# Altium project Thermistor_Expansion_PCB_GND.PrjPcb
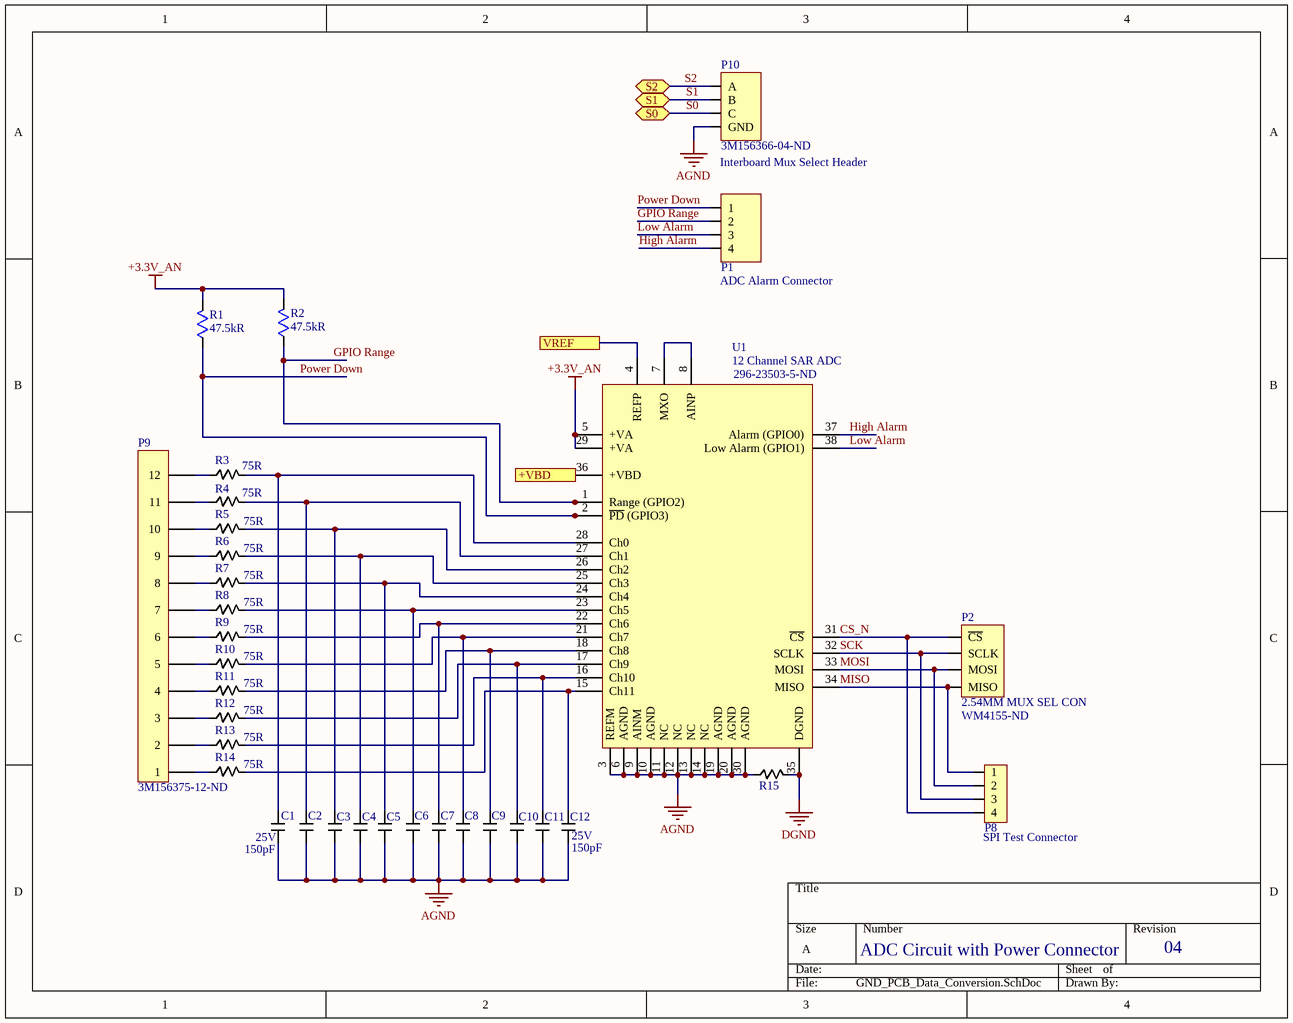
[diagram p0: GND_PCB_Data_Conversion.SchDoc]
3 sheets, 54 parts. Net scope: flat (ports and power ports of the same name join across sheets).
Board file: Middle_Stack_PCB.PcbDoc
Sheets:
  GND_PCB_Data_Conversion.SchDoc
  4X_22_GND_Pin_Connector.SchDoc
  ADC_PowerSupply.SchDoc

## Sheet GND_PCB_Data_Conversion.SchDoc
size A

### Parts
C1  Capacitance: 150pF  Voltage Rating: 25V  [150PF Cap Charge Resevoir]  (hidden comment: 150PF Charge Res Caps)
C2  150PF Charge Res Caps  [150PF Cap Charge Resevoir]  (value not drawn)
C3  150PF Charge Res Caps  [150PF Cap Charge Resevoir]  (value not drawn)
C4  150PF Charge Res Caps  [150PF Cap Charge Resevoir]  (value not drawn)
C5  150PF Charge Res Caps  [150PF Cap Charge Resevoir]  (value not drawn)
C6  150PF Charge Res Caps  [150PF Cap Charge Resevoir]  (value not drawn)
C7  150PF Charge Res Caps  [150PF Cap Charge Resevoir]  (value not drawn)
C8  150PF Charge Res Caps  [150PF Cap Charge Resevoir]  (value not drawn)
C9  150PF Charge Res Caps  [150PF Cap Charge Resevoir]  (value not drawn)
C10  150PF Charge Res Caps  [150PF Cap Charge Resevoir]  (value not drawn)
C11  150PF Charge Res Caps  [150PF Cap Charge Resevoir]  (value not drawn)
C12  Capacitance: 150pF  Voltage Rating: 25V  [150PF Cap Charge Resevoir]  (hidden comment: 150PF Charge Res Caps)
P1  4 pos ADC Alarm Header  [4POS 2.54MM HEADER MUX SEL]  (value not drawn)
P2  2.54MM MUX SEL CON  Supplier Part Number 1: WM4155-ND  [4POS 2.54MM HEADER MUX SEL]
P8  4POS SPI Test Connector Header Pin  [4POS SPI Test Connector]  (value not drawn)
P9  Supplier Part Number 1: 3M156375-12-ND  [12POS Dual Header W/0 3D Body]  (hidden comment: 12POS Dual Header W/O 3D Body)
P10  Supplier Part Number 1: 3M156366-04-ND  [Mux Select Interboard Connector]  (hidden comment: Mux Select Interboard Header)
R1  Resistance: 47.5kR  [Green_LED_Resistor_90.9]  (hidden comment: Green)
R2  Resistance: 47.5kR  [0603_MD_RES]  (hidden comment: 47.5k PullUp RES ADC)
R3  Resistance: 75R  [Chip2PinSM127P600-8N]  (hidden comment: 75 Ohm Charge Resevoir Resistor)
R4  Resistance: 75R  [Chip2PinSM127P600-8N]  (hidden comment: 75 Ohm Charge Resevoir Resistor)
R5  Resistance: 75R  [Chip2PinSM127P600-8N]  (hidden comment: 75 Ohm Charge Resevoir Resistor)
R6  Resistance: 75R  [Chip2PinSM127P600-8N]  (hidden comment: 75 Ohm Charge Resevoir Resistor)
R7  Resistance: 75R  [Chip2PinSM127P600-8N]  (hidden comment: 75 Ohm Charge Resevoir Resistor)
R8  Resistance: 75R  [Chip2PinSM127P600-8N]  (hidden comment: 75 Ohm Charge Resevoir Resistor)
R9  Resistance: 75R  [Chip2PinSM127P600-8N]  (hidden comment: 75 Ohm Charge Resevoir Resistor)
R10  Resistance: 75R  [Chip2PinSM127P600-8N]  (hidden comment: 75 Ohm Charge Resevoir Resistor)
R11  Resistance: 75R  [Chip2PinSM127P600-8N]  (hidden comment: 75 Ohm Charge Resevoir Resistor)
R12  Resistance: 75R  [Chip2PinSM127P600-8N]  (hidden comment: 75 Ohm Charge Resevoir Resistor)
R13  Resistance: 75R  [Chip2PinSM127P600-8N]  (hidden comment: 75 Ohm Charge Resevoir Resistor)
R14  Resistance: 75R  [Chip2PinSM127P600-8N]  (hidden comment: 75 Ohm Charge Resevoir Resistor)
R15  0 Ohm Resistor  [0 Ohm Resistor]  (value not drawn)
U1  12 Channel SAR ADC  Supplier Part Number 1: 296-23503-5-ND  [12 Channel SAR ADC]

### Ports
+VBD, S0 (bidir), S1 (bidir), S2 (bidir), VREF

### Nets
+3.3V_AN: R1.2 R2.2 U1.5(+VA) U1.29(+VA)
AGND: C1.1 C2.1 C3.1 C4.1 C5.1 C6.1 C7.1 C8.1 C9.1 C10.1 C11.1 C12.1 P10.4(GND) R15.1 U1.3(REFM) U1.6(AGND) U1.9(AINM) U1.10(AGND) U1.11(NC) U1.12(NC) U1.13(NC) U1.14(NC) U1.19(AGND) U1.20(AGND) U1.30(AGND)
DGND: R15.2 U1.35(DGND)
+VBD: U1.36(+VBD) ; port +VBD
CS_N: P2.4(~{CS}) P8.4 U1.31(~{CS})
GPIO Range: P1.2 R2.1 U1.1(Range_(GPIO2))
High Alarm: P1.4 U1.37(Alarm_(GPIO0))
Low Alarm: P1.3 U1.38(Low_Alarm_(GPIO1))
MISO: P2.1(MISO) P8.1 U1.34(MISO)
MOSI: P2.2(MOSI) P8.2 U1.33(MOSI)
Power Down: P1.1 R1.1 U1.2(~{PD}_(GPIO3))
S0: P10.3(C) ; port S0
S1: P10.2(B) ; port S1
S2: P10.1(A) ; port S2
SCK: P2.3(SCLK) P8.3 U1.32(SCLK)
VREF: U1.4(REFP) ; port VREF
NetC1_2: C1.2 R3.2 U1.28(Ch0)
NetC2_2: C2.2 R4.2 U1.27(Ch1)
NetC3_2: C3.2 R5.2 U1.26(Ch2)
NetC4_2: C4.2 R6.2 U1.25(Ch3)
NetC5_2: C5.2 R7.2 U1.24(Ch4)
NetC6_2: C6.2 R8.2 U1.23(Ch5)
NetC7_2: C7.2 R9.2 U1.22(Ch6)
NetC8_2: C8.2 R10.2 U1.21(Ch7)
NetC9_2: C9.2 R11.2 U1.18(Ch8)
NetC10_2: C10.2 R12.2 U1.17(Ch9)
NetC11_2: C11.2 R13.2 U1.16(Ch10)
NetC12_2: C12.2 R14.2 U1.15(Ch11)
NetP9_1: P9.1 R14.1
NetP9_2: P9.2 R13.1
NetP9_3: P9.3 R12.1
NetP9_4: P9.4 R11.1
NetP9_5: P9.5 R10.1
NetP9_6: P9.6 R9.1
NetP9_7: P9.7 R8.1
NetP9_8: P9.8 R7.1
NetP9_9: P9.9 R6.1
NetP9_10: P9.10 R5.1
NetP9_11: P9.11 R4.1
NetP9_12: P9.12 R3.1
NetU1_7: U1.7(MXO) U1.8(AINP)

### Notes on the sheet
- Interboard Mux Select Header
- (near P1) ADC Alarm Connector
- (near P8) SPI Test Connector
- ADC Circuit with Power Connector
- 04

### Library data of the parts
C1-C12 = 150PF Charge Res Caps: Charge Res Caps for ADC input channels; Manufacturer: KEMET; Manufacturer Part Number: C0402C151J3GAC7867; Tolerance: 5%; Supplier 1: Digi-Key; Stock 1: 18237; Pricing 1: 1=0.10000, 10=0.04300, 100=0.01920, 500=0.01374, 1000=0.01080, 2500=0.00982, 5000=0.00903 (USD); Mount: Surface Mount; Case/Package: 0402; Min Operating Temperature: -55°C; Max Operating Temperature: 125°C; Packaging: Cut Tape; ComponentLink1URL: http://components.arrow.com/part/dataview/46126249S9911696N7429?src-supplier=Arrow; ComponentLink1Description: http://components.arrow.com/part/dataview/46126249S9911696N7429?src-supplier=Arrow; ComponentLink2URL: http://www.kemet.com/docfinder?Partnumber=C0402C151J3GACTU&src-supplier=Digi-Key; ComponentLink2Description: http://www.kemet.com/docfinder?Partnumber=C0402C151J3GACTU&src-supplier=Digi-Key; Supplier Part Number 1: 399-14422-1-ND; Case Code (Imperial): 0402; Case Code (Metric): 1005; ComponentLink3URL: https://api.kemet.com/component-edge/download/datasheet/C0402C151J3GACTU.pdf?src-supplier=Digi-Key; ComponentLink3Description: https://api.kemet.com/component-edge/download/datasheet/C0402C151J3GACTU.pdf?src-supplier=Digi-Key; ComponentLink4URL: http://datasheet.octopart.com/C0402C151J3GAC7867-KEMET-datasheet-84169754.pdf; ComponentLink4Description: http://datasheet.octopart.com/C0402C151J3GAC7867-KEMET-datasheet-84169754.pdf
P1 = 4 pos ADC Alarm Header: Connector Header Through Hole, Right Angle 4 position 0.100" (2.54mm); Manufacturer: Molex; Manufacturer Part Number: 0705530108; Contact Resistance: 30mR; Number of Positions: 4; Connector Type: Male Pin; Pitch: 0.1inch; Supplier 1: Digi-Key; Stock 1: 858; Pricing 1: 1=2.03000, 10=1.83800, 100=1.57500, 500=1.31250, 1000=1.12500, 5000=0.99750, 10000=0.97500 (USD); RoHS: Yes; Mount: Through Hole; Contact Plating: Gold; Contact Material: Bronze; Housing Material: Polyester; Color: Black; Housing Color: Black; Min Operating Temperature: -40°C; Max Operating Temperature: 105°C; Number of Rows: 1; Packaging: Rail/Tube; Termination: Solder; Orientation: Right Angle; Fastening Type: Latch; Length: 12.71mm; Contact Mating Length: 0.24inch; Depth: 13.59mm; Radiation Hardening: No; ComponentLink1URL: https://datasheet.ciiva.com/6829/705530106-sd-6829901.pdf?src-supplier=Digi-Key; ComponentLink1Description: https://datasheet.ciiva.com/6829/705530106-sd-6829901.pdf?src-supplier=Digi-Key; ComponentLink2URL: https://datasheet.ciiva.com/16498/0705530108-pcb-headers-16498173.pdf?src-supplier=Avnet+Asia; ComponentLink2Description: https://datasheet.ciiva.com/16498/0705530108-pcb-headers-16498173.pdf?src-supplier=Avnet+Asia; Supplier Part Number 1: WM4155-ND
P2 = 2.54MM MUX SEL CON: SPI Connector; Manufacturer: Molex; Manufacturer Part Number: 0705530108; Contact Resistance: 30mR; Number of Positions: 4; Connector Type: Male Pin; Pitch: 0.1inch; Voltage Rating: 250V; Current Rating: 3A; Gender: Male; Insulation Resistance: 1GR; Glow Wire Compliant: Non-compliant; Supplier 1: Digi-Key; Stock 1: 1281; Mount: Through Hole; Contact Plating: Gold; Contact Material: Bronze; Housing Material: Polyester; Color: Black; Housing Color: Black; Min Operating Temperature: -40°C; Max Operating Temperature: 105°C; Number of Rows: 1; Packaging: Rail/Tube; Termination: Solder; Orientation: Right Angle; Fastening Type: Latch; Length: 12.71mm; Contact Mating Length: 0.24inch; Depth: 13.59mm; Radiation Hardening: No; ComponentLink1URL: https://www.molex.com/pdm_docs/ps/PS-70400.pdf?src-supplier=Digi-Key; ComponentLink1Description: https://www.molex.com/pdm_docs/ps/PS-70400.pdf?src-supplier=Digi-Key; ComponentLink2URL: http://www.molex.com/webdocs/datasheets/pdf/en-us/0705530108_PCB_HEADERS.pdf?src-supplier=Avnet+Asia; ComponentLink2Description: http://www.molex.com/webdocs/datasheets/pdf/en-us/0705530108_PCB_HEADERS.pdf?src-supplier=Avnet+Asia; Pricing 1: 1=2.03, 10=1.838, 100=1.575, 500=1.3125, 1680=1.0875, 5040=0.9975, 10080=0.975 (USD); Material: Brass; Package Quantity: 1680; Number of Contacts: 4; Voltage Rating (DC): 250V; Number of Circuits: 4; REACH SVHC: Unknown; ELV: Compliant; Flammability Rating: UL94 V-0; ComponentLink3URL: http://www.farnell.com/datasheets/2027073.pdf?src-supplier=Element14; ComponentLink3Description: http://www.farnell.com/datasheets/2027073.pdf?src-supplier=Element14; ComponentLink4URL: http://www.molex.com/webdocs/datasheets/pdf/en-us/0705530108_PCB_HEADERS.pdf?src-supplier=Avnet; ComponentLink4Description: http://www.molex.com/webdocs/datasheets/pdf/en-us/0705530108_PCB_HEADERS.pdf?src-supplier=Avnet; ComponentLink5URL: http://www.mouser.com/ds/2/276/0705530108_PCB_HEADERS-172949.pdf?src-supplier=Mouser; ComponentLink5Description: http://www.mouser.com/ds/2/276/0705530108_PCB_HEADERS-172949.pdf?src-supplier=Mouser
P8 = 4POS SPI Test Connector Header Pin: Connector Header Through Hole, Right Angle 4 position 0.100" (2.54mm); Manufacturer: TE Connectivity; Manufacturer Part Number: 640455-4; Underplate Material: Nickel; Contact Resistance: 6mR; Current Rating: 5A; Voltage Rating: 250V; Number of Positions: 4; Connector Type: Plug,Header,Pin; Backwall/Post Interruptions: No (Without); Connector System: Wire-to-Board; Plating Thickness: 3.81um; PCB Mount Retention: Without; Contact Post Length: 3.56mm; PCB Thickness: 0.063inch; Approvals: CSA; Supplier 1: Digi-Key; Stock 1: 4333; Pricing 1: 1=0.14000, 10=0.12700, 100=0.08780, 500=0.07430, 1000=0.06080, 5000=0.05404, 10000=0.05066 (USD); RoHS: Yes; Mount: Through Hole; Contact Material: Copper Alloy; Contact Plating: Tin; Color: Natural,Beige; Housing Color: Natural; Housing Material: Polyester; Contact Shape: Square; Min Operating Temperature: -67°C; Max Operating Temperature: 221°C; Number of Rows: 1; Packaging: Bulk; Package Quantity: 1; Contact Gender: Male; Max Voltage Rating (AC): 250V; Termination: Solder; Number of Contacts: 4; Orientation: Right Angle; Voltage Rating (AC): 250V; Contact Retention: No (Without); Mating Alignment: No (Without); Mating Retention: No (Without); PCB Mount Alignment: No (Without); PCB Mounting Orientation: Right Angle; Sealable: No (Without); Strain Relief: No (Without); Shrouded: No (Without); Contact Current Rating: 5A; Length: 0.4inch; Height: 7.75mm; Pitch: 2.54mm; Contact Mating Length: 0.295inch; Depth: 11.05mm; Tail Length: 3.56mm; Radiation Hardening: No; REACH SVHC: Unknown; Flammability Rating: UL94 V-0; ELV: Compliant; Lead Free: Lead Free; ComponentLink1URL: https://datasheet.ciiva.com/16499/eng-ds-82056-mta-0608-16499288.pdf?src-supplier=Future+Electronics; ComponentLink1Description: https://datasheet.ciiva.com/16499/eng-ds-82056-mta-0608-16499288.pdf?src-supplier=Future+Electronics; ComponentLink2URL: https://datasheet.ciiva.com/11752/0900766b81020fb4-11752965.pdf?src-supplier=RSComponents; ComponentLink2Description: https://datasheet.ciiva.com/11752/0900766b81020fb4-11752965.pdf?src-supplier=RSComponents; ComponentLink3URL: https://datasheet.ciiva.com/30226/8852eng-ds-82056-mta-0608-30226713.pdf?src-supplier=Onlinecomponents.com; ComponentLink3Description: https://datasheet.ciiva.com/30226/8852eng-ds-82056-mta-0608-30226713.pdf?src-supplier=Onlinecomponents.com; ComponentLink4URL: https://datasheet.ciiva.com/709/eng-cd-640455-y2-709686.pdf?src-supplier=Digi-Key; ComponentLink4Description: https://datasheet.ciiva.com/709/eng-cd-640455-y2-709686.pdf?src-supplier=Digi-Key; Supplier Part Number 1: A19452-ND
P9 = 12POS Dual Header W/O 3D Body: Connector Header Through Hole 12 position 0.100" (2.54mm); Manufacturer: 3M; Manufacturer Part Number: 929715-06-06-EU; Number of Positions: 12; Gender: Male; Connector Type: Male Pin; Pitch: 0.1inch; Supplier 1: Digi-Key; Stock 1: 0; Pricing 1: 1=1.86000, 10=1.69000, 25=1.58600, 50=1.51720, 100=1.44820, 250=1.31024, 500=1.20680 (USD); RoHS: Yes; Mount: Through Hole; Color: Black; Contact Plating: Gold; Package Quantity: 500; Number of Rows: 2; Packaging: Bulk; Termination: Solder; Row Spacing: 0.1inch; Contact Mating Length: 0.318inch; ComponentLink1URL: http://components.arrow.com/part/dataview/42715320S8912076N3321?src-supplier=Arrow; ComponentLink1Description: http://components.arrow.com/part/dataview/42715320S8912076N3321?src-supplier=Arrow; ComponentLink2URL: http://www.mouser.com/ds/2/1/ts0769-35914.pdf?src-supplier=Mouser; ComponentLink2Description: http://www.mouser.com/ds/2/1/ts0769-35914.pdf?src-supplier=Mouser; ComponentLink3URL: http://multimedia.3m.com/mws/mediawebserver?66666UuZjcFSLXTtmXME5x46EVuQEcuZgVs6EVs6E666666--?src-supplier=Digi-Key; ComponentLink3Description: http://multimedia.3m.com/mws/mediawebserver?66666UuZjcFSLXTtmXME5x46EVuQEcuZgVs6EVs6E666666--?src-supplier=Digi-Key
P10 = Mux Select Interboard Header: Connector Header Through Hole 4 position 0.100" (2.54mm); Manufacturer: 3M; Manufacturer Part Number: 929710-06-02-RK; Number of Positions: 4; Gender: Male; Connector Type: Male Pin; Pitch: 0.1inch; Supplier 1: Digi-Key; Stock 1: 0; Pricing 1: 1=0.55000, 10=0.52000, 25=0.46800, 50=0.41600, 100=0.39870, 250=0.36400, 500=0.34666 (USD); Mount: Through Hole; Color: Black; Contact Plating: Tin; Package Quantity: 1000; Number of Rows: 2; Packaging: Bulk; Termination: Solder; Row Spacing: 0.1inch; Contact Mating Length: 0.318inch; ComponentLink1URL: https://datasheet.ciiva.com/6818/ts0769-6818121.pdf?src-supplier=Digi-Key; ComponentLink1Description: https://datasheet.ciiva.com/6818/ts0769-6818121.pdf?src-supplier=Digi-Key; ComponentLink2URL: https://datasheet.ciiva.com/15402/ts0769-15402221.pdf?src-supplier=Mouser; ComponentLink2Description: https://datasheet.ciiva.com/15402/ts0769-15402221.pdf?src-supplier=Mouser
R1 R2 = 47.5k PullUp RES ADC: RES 47.5K OHM 0.5% 1/10W 0603; Manufacturer: Stackpole Electronics; Manufacturer Part Number: RNCF0603DTE47K5; Power Rating: 63mW; Mount: Surface Mount; Case/Package: 0603; Min Operating Temperature: -55°C; Max Operating Temperature: 155°C; Tolerance: 0.5%; Packaging: Tape and Reel; ComponentLink1URL: http://datasheet.octopart.com/RNCF0603DTE47K5-Stackpole-Electronics-datasheet-10788241.pdf?src-supplier=Stackpole+Electronics; ComponentLink1Description: http://datasheet.octopart.com/RNCF0603DTE47K5-Stackpole-Electronics-datasheet-10788241.pdf?src-supplier=Stackpole+Electronics; ComponentLink2URL: http://datasheet.octopart.com/RNCF0603DTE47K5-Stackpole-Electronics-datasheet-12511394.pdf?src-supplier=Stackpole+Electronics; ComponentLink2Description: http://datasheet.octopart.com/RNCF0603DTE47K5-Stackpole-Electronics-datasheet-12511394.pdf?src-supplier=Stackpole+Electronics; ComponentLink3URL: http://datasheet.octopart.com/RNCF0603DTE47K5-Stackpole-Electronics-datasheet-11755897.pdf; ComponentLink3Description: http://datasheet.octopart.com/RNCF0603DTE47K5-Stackpole-Electronics-datasheet-11755897.pdf; Supplier 1: Digi-Key; Stock 1: 5000; Pricing 1: 1=0.15000, 10=0.12700, 100=0.04970, 1000=0.02079, 2500=0.01906 (USD); Supplier Part Number 1: RNCF0603DTE47K5CT-ND
R3-R14 = 75 Ohm Charge Resevoir Resistor: Manufacturer: Rohm; Manufacturer Part Number: KTR03EZPF75R0; Tolerance: 1%; Max Power Dissipation: 100mW; Temperature Coefficient: 100ppm/°C; Supplier 1: Digi-Key; Stock 1: 9052; Pricing 1: 1=0.15000, 10=0.13500, 100=0.05200, 1000=0.02287, 2500=0.01975 (USD); RoHS: Yes; Case/Package: 0603; Case Code (Metric): 1608; Case Code (Imperial): 0603; Min Operating Temperature: -55°C; Max Operating Temperature: 155°C; Package Quantity: 1; Packaging: Cut Tape; Composition: Thick Film; Number of Terminations: 2; Features: Automotive AEC-Q200; Length: 0.063inch; Height: 0.022inch; Width: 0.031inch; ComponentLink1URL: https://datasheet.ciiva.com/14930/ktr-14930245.pdf?src-supplier=Digi-Key; ComponentLink1Description: https://datasheet.ciiva.com/14930/ktr-14930245.pdf?src-supplier=Digi-Key; ComponentLink2URL: https://datasheet.ciiva.com/14924/ktr-14924923.pdf?src-supplier=Digi-Key; ComponentLink2Description: https://datasheet.ciiva.com/14924/ktr-14924923.pdf?src-supplier=Digi-Key; ComponentLink3URL: https://datasheet.ciiva.com/14928/ktr-14928475.pdf?src-supplier=Digi-Key; ComponentLink3Description: https://datasheet.ciiva.com/14928/ktr-14928475.pdf?src-supplier=Digi-Key; Supplier Part Number 1: RHM75AYCT-ND
R15 = 0 Ohm Resistor: 0 Ohm Resistor for connecting polygon pours
U1 = 12 Channel SAR ADC: 12 Bit SAR ADC; Manufacturer: Texas Instruments; Manufacturer Part Number: ADS7952SDBT; Min Supply Voltage: 2.7V; Max Supply Voltage: 5.25V; Interface: SPI; Number of Channels: 12; Sampling Rate: 1MS/s; Number of Converters: 1; Resolution: 12b; Polarity: Unipolar; Supply Type: Analog; Integral Nonlinearity (INL): 1.5LSB; Signal to Noise Ratio (SNR): 71.7dB; Power Consumption: 11.5mW; Operating Supply Voltage: 3.3V; Full Scale Error: 2LSB; Power Dissipation: 14.5mW; Nominal Supply Current: 2.3mA; Supplier 1: Digi-Key; Stock 1: 1697; Pricing 1: 1=9.30000, 10=8.40000, 50=8.00940, 100=6.95450, 500=6.05586, 1000=5.27445 (USD); RoHS: Yes; Mount: Surface Mount; Case/Package: TSSOP; Number of Pins: 38; Contact Plating: Gold; Min Operating Temperature: -40°C; Max Operating Temperature: 125°C; Packaging: Rail/Tube; Package Quantity: 50; Number of Bits: 12; Number of Elements: 1; Number of A/D Converters: 1; Number of Analog Inputs: 12; Conversion Rate: 1MS/s; Number of Inputs: 12; Radiation Hardening: No; Lead Free: Lead Free; REACH SVHC: No SVHC; ComponentLink1URL: https://datasheet.ciiva.com/41460/001186285-da-01-en-ic-adc-12bit-1m-ads7952sdbt-tssop-38-tid-41460243.pdf?src-supplier=Conrad; ComponentLink1Description: https://datasheet.ciiva.com/41460/001186285-da-01-en-ic-adc-12bit-1m-ads7952sdbt-tssop-38-tid-41460243.pdf?src-supplier=Conrad; ComponentLink2URL: https://datasheet.ciiva.com/14258/ads7961-14258981.pdf?src-supplier=Avnet; ComponentLink2Description: https://datasheet.ciiva.com/14258/ads7961-14258981.pdf?src-supplier=Avnet; ComponentLink3URL: https://datasheet.ciiva.com/1263/ads7950-1263926.pdf?src-supplier=Digi-Key; ComponentLink3Description: https://datasheet.ciiva.com/1263/ads7950-1263926.pdf?src-supplier=Digi-Key

## Sheet 4X_22_GND_Pin_Connector.SchDoc
size A
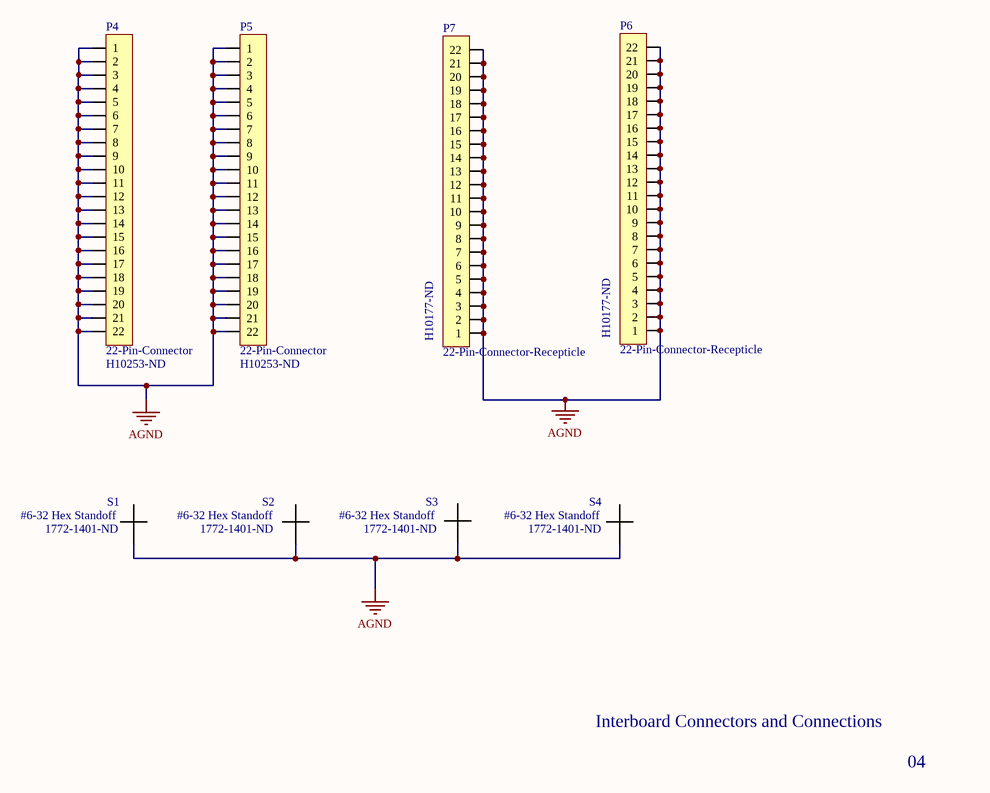
[diagram p1: 4X_22_GND_Pin_Connector.SchDoc]

### Parts
P4  22-Pin-Connector  Supplier Part Number 1: H10253-ND  [22-Pin Conenctor]
P5  22-Pin-Connector  Supplier Part Number 1: H10253-ND  [22-Pin Conenctor]
P6  22-Pin-Connector-Recepticle  Supplier Part Number 1: H10177-ND  [22 POS Connector Recepticle]
P7  22-Pin-Connector-Recepticle  Supplier Part Number 1: H10177-ND  [22 POS Connector Recepticle]
S1  #6-32 Hex Standoff  Supplier Part Number 1: 1772-1401-ND  [#6-32 GND Standoff]
S2  #6-32 Hex Standoff  Supplier Part Number 1: 1772-1401-ND  [#6-32 GND Standoff]
S3  #6-32 Hex Standoff  Supplier Part Number 1: 1772-1401-ND  [#6-32 GND Standoff]
S4  #6-32 Hex Standoff  Supplier Part Number 1: 1772-1401-ND  [#6-32 GND Standoff]

### Nets
AGND: P4.1 P4.2 P4.3 P4.4 P4.5 P4.6 P4.7 P4.8 P4.9 P4.10 P4.11 P4.12 P4.13 P4.14 P4.15 P4.16 P4.17 P4.18 P4.19 P4.20 P4.21 P4.22 P5.1 P5.2 P5.3 P5.4 P5.5 P5.6 P5.7 P5.8 P5.9 P5.10 P5.11 P5.12 P5.13 P5.14 P5.15 P5.16 P5.17 P5.18 P5.19 P5.20 P5.21 P5.22 P6.1 P6.2 P6.3 P6.4 P6.5 P6.6 P6.7 P6.8 P6.9 P6.10 P6.11 P6.12 P6.13 P6.14 P6.15 P6.16 P6.17 P6.18 P6.19 P6.20 P6.21 P6.22 P7.1 P7.2 P7.3 P7.4 P7.5 P7.6 P7.7 P7.8 P7.9 P7.10 P7.11 P7.12 P7.13 P7.14 P7.15 P7.16 P7.17 P7.18 P7.19 P7.20 P7.21 P7.22 S1.1 S2.1 S3.1 S4.1

### Notes on the sheet
- Interboard Connectors and Connections
- 04

### Library data of the parts
P4 P5 = 22-Pin-Connector: Current Therm Connector; Manufacturer: Hirose; Manufacturer Part Number: DF11-22DP-2DS(24); Number of Contacts: 22; Gender: Male; Connector Type: Male Pin; Contact Resistance: 30mR; Max Current Rating: 2A; Voltage Rating: 250V; Pitch: 2mm; Row Spacing: 0.079inch; Mount: Through Hole; Contact Plating: Tin; Contact Material: Brass,Copper Alloy,Tin; Color: Black; Housing Color: Black; Housing Material: Polyamide; Min Operating Temperature: -30°C; Max Operating Temperature: 85°C; Number of Rows: 2; Termination: Solder; Packaging: Rail/Tube; Package Quantity: 20; Fastening Type: Detent; Number of Positions: 22; Current Rating: 2A; Orientation: Right Angle; Length: 24mm; Height: 5mm; Contact Mating Length: 0.118inch; Depth: 10mm; Radiation Hardening: No; Lead Free: Lead Free; ComponentLink1URL: http://docs-usa.electrocomponents.com/techlib:/itc_doclist_US.htm?stockno=6888963&src-supplier=Allied+Electronics; ComponentLink1Description: http://docs-usa.electrocomponents.com/techlib:/itc_doclist_US.htm?stockno=6888963&src-supplier=Allied+Electronics; ComponentLink2URL: https://www.verical.com/server-webapp/html/getDatasheet?partID=456315&src-supplier=Verical; ComponentLink2Description: https://www.verical.com/server-webapp/html/getDatasheet?partID=456315&src-supplier=Verical; ComponentLink3URL: http://www.hirose.co.jp/cataloge_hp/en_DF11_20130411.pdf?src-supplier=Future+Electronics; ComponentLink3Description: http://www.hirose.co.jp/cataloge_hp/en_DF11_20130411.pdf?src-supplier=Future+Electronics; ComponentLink4URL: http://www.farnell.com/datasheets/91550.pdf?src-supplier=Element14; ComponentLink4Description: http://www.farnell.com/datasheets/91550.pdf?src-supplier=Element14; ComponentLink5URL: http://www.mouser.com/ds/2/185/DF11_catalog-1064296.pdf?src-supplier=Mouser; ComponentLink5Description: http://www.mouser.com/ds/2/185/DF11_catalog-1064296.pdf?src-supplier=Mouser; ComponentLink6URL: http://documents.rs-components.com/techlib://itc_doclist_GB.htm?stockno=6056598&src-supplier=RSComponents; ComponentLink6Description: http://documents.rs-components.com/techlib://itc_doclist_GB.htm?stockno=6056598&src-supplier=RSComponents; Supplier 1: Digi-Key; Stock 1: 3536; Pricing 1: 1=1.19, 20=1.0455, 100=0.902, 500=0.738, 1000=0.656 (USD)
P6 P7 = 22-Pin-Connector-Recepticle: Manufacturer: Hirose; Manufacturer Part Number: DF11-22DS-2DSA(05); Contact Resistance: 30mR; Mating Cycles: 30; Voltage Rating (AC): 30V; Current Rating: 2A; Number of Positions: 22; Connector Type: Receptacle; Insulation Resistance: 1GR; Pitch: 2mm; Row Spacing: 0.079inch; Supplier 1: Digi-Key; Stock 1: 843; Pricing 1: 1=1.40000, 10=1.27400, 100=1.09200, 500=0.91000, 1000=0.78000 (USD); RoHS: Yes; Mount: Through Hole; Contact Plating: Tin; Contact Material: Copper; Color: Black; Housing Color: Black; Housing Material: Polyamide; Number of Rows: 2; Contact Gender: Female; Package Quantity: 100; Packaging: Bulk; Termination: Through Hole; Gender: Receptacle; Number of Contacts: 22; Orientation: Straight; Lead Pitch: 2mm; REACH SVHC: No SVHC; Lead Free: Lead Free; Flammability Rating: UL94 V-0; ComponentLink1URL: https://datasheet.ciiva.com/11752/0900766b80d975f3-11752361.pdf?src-supplier=RSComponents; ComponentLink1Description: https://datasheet.ciiva.com/11752/0900766b80d975f3-11752361.pdf?src-supplier=RSComponents; ComponentLink2URL: https://datasheet.ciiva.com/14122/df11serie-eng-tds-14122182.pdf?src-supplier=Distrelec; ComponentLink2Description: https://datasheet.ciiva.com/14122/df11serie-eng-tds-14122182.pdf?src-supplier=Distrelec; ComponentLink3URL: https://datasheet.ciiva.com/5155/en-df11-20130411-258217-5155093.pdf?src-supplier=Mouser; ComponentLink3Description: https://datasheet.ciiva.com/5155/en-df11-20130411-258217-5155093.pdf?src-supplier=Mouser
S1-S4 = #6-32 Hex Standoff: Hex standoff for Thermistor GND Board; Manufacturer: RAF; Manufacturer Part Number: 2104-632-AL; Gender: Female to Female; System: Connector; RoHS: Yes; Case/Package: Aluminum; Material: Aluminium; Shape: Hex; Length: 0.5inch; ComponentLink1URL: https://datasheet.ciiva.com/18425/70006493-18425850.pdf?src-supplier=Allied+Electronics; ComponentLink1Description: https://datasheet.ciiva.com/18425/70006493-18425850.pdf?src-supplier=Allied+Electronics; ComponentLink2URL: https://datasheet.ciiva.com/30059/2101-1032-b-5-30059595.pdf?src-supplier=Onlinecomponents.com; ComponentLink2Description: https://datasheet.ciiva.com/30059/2101-1032-b-5-30059595.pdf?src-supplier=Onlinecomponents.com; Supplier 1: Digi-Key; Stock 1: 3884; Pricing 1: 1=0.26000, 25=0.17400, 100=0.14820, 250=0.14080, 500=0.13338, 1000=0.12597 (USD)

## Sheet ADC_PowerSupply.SchDoc
size A4; Organization: Altium Limited; Address1: L3, 12a Rodborough Rd; Address2: Frenchs Forest; Address3: NSW; Address4: Australia 2086
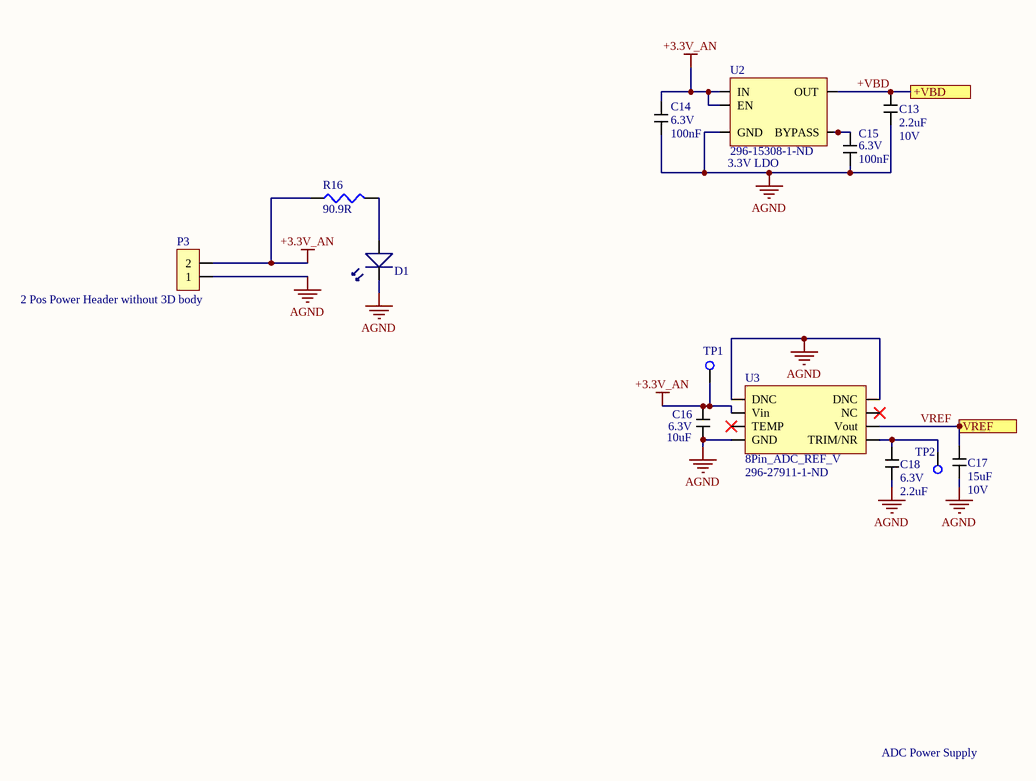
[diagram p2: ADC_PowerSupply.SchDoc]

### Parts
C13  Capacitance: 2.2uF  Voltage Rating: 10V  [2.2uF LDO Output Bypass Cap]  (hidden comment: 2.2uF LDO Bypass Cap)
C14  Voltage Rating: 6.3V  Capacitance: 100nF  [0.1uF Bypass Capacitor]  (hidden comment: 0.1uF)
C15  Voltage Rating: 6.3V  Capacitance: 100nF  [0.1uF Bypass Capacitor]  (hidden comment: 0.1uF)
C16  Voltage Rating: 6.3V  Capacitance: 10uF  [0805_MD_CAP]  (hidden comment: ADC_Volt_Ref_Input_Bypass_CAP10uF)
C17  Capacitance: 15uF  Voltage Rating: 10V  [1206_MD_CAP_Width_MOD]  (hidden comment: ADC_REF_VOLT_OUTPUT_CAP15UF)
C18  Voltage Rating: 6.3V  Capacitance: 2.2uF  [0603_MD_CAP]  (hidden comment: ADC_REF_VOLT_TRIM_CAP2.2UF)
D1  LED  [Green_SMD_LED]  (value not drawn)
P3  2 Pos Power Header without 3D body  [2 Pos Power Header - duplicate]
R16  Resistance: 90.9R  [Green_LED_Resistor_90.9]  (hidden comment: Green)
TP1  Test Point  [Test Point]  (value not drawn)
TP2  Test Point  [Test Point]  (value not drawn)
U2  Supplier Part Number 1: 296-15308-1-ND  [3.3V Dig ADC Supply]  (hidden comment: 3.3V Digital ADC Supply)
U3  8Pin_ADC_REF_V  Supplier Part Number 1: 296-27911-1-ND  [SOIC127P600X175-8N]

### Ports
+VBD, VREF

### Nets
+3.3V_AN: C14.2 C16.2 P3.2 R16.1 TP1.1 U2.1(IN) U2.3(EN) U3.2(Vin)
AGND: C13.1 C14.1 C15.1 C16.1 C17.1 C18.1 D1.1 P3.1 U2.2(GND) U3.1(DNC) U3.4(GND) U3.8(DNC)
+VBD: C13.2 U2.5(OUT) ; port +VBD
VREF: C17.2 U3.6(Vout) ; port VREF
NetC15_2: C15.2 U2.4(BYPASS)
NetC18_2: C18.2 TP2.1 U3.5(TRIM/NR)
NetD1_2: D1.2 R16.2

Not connected (* = marked no-connect by the designer): U3 3(TEMP)* 7(NC)*

### Notes on the sheet
- (near U2) 3.3V LDO
- ADC Power Supply
- Title
- Size:
- Date:
- A4
- Number:
- Time:
- Revision:
- Sheet
- of
- File:

### Library data of the parts
C13 = 2.2uF LDO Bypass Cap: 2.2µF ±10% 10V Ceramic Capacitor X7R 0805 (2012 Metric); Manufacturer: KEMET; Manufacturer Part Number: C0805C225K8RACAUTO; Supplier 1: Digi-Key; Stock 1: 53616; Pricing 1: 1=0.25000, 10=0.17200, 100=0.09770, 500=0.06898, 1000=0.06035 (USD); RoHS: Yes; Mount: Surface Mount; Case/Package: 0805; Case Code (Metric): 2012; Case Code (Imperial): 0805; Dielectric Material: Ceramic; Min Operating Temperature: -55°C; Max Operating Temperature: 125°C; Tolerance: 10%; Package Quantity: 1; Packaging: Cut Tape; Dielectric: X7R; Voltage Rating (DC): 10V; Length: 2mm; Height: 1.25mm; Width: 0.049inch; Thickness: 0.055inch; Depth: 1.25mm; Ratings: AEC-Q200; Radiation Hardening: No; REACH SVHC: No SVHC; ComponentLink1URL: http://www.farnell.com/datasheets/2741162.pdf?src-supplier=Farnell; ComponentLink1Description: http://www.farnell.com/datasheets/2741162.pdf?src-supplier=Farnell; ComponentLink2URL: http://components.arrow.com/part/dataview/0323_00327875?src-supplier=Arrow+Europe; ComponentLink2Description: http://components.arrow.com/part/dataview/0323_00327875?src-supplier=Arrow+Europe; ComponentLink3URL: http://components.arrow.com/part/dataview/43510464S9781270N7429?src-supplier=Arrow; ComponentLink3Description: http://components.arrow.com/part/dataview/43510464S9781270N7429?src-supplier=Arrow; ComponentLink4URL: http://www.farnell.com/datasheets/2741162.pdf?src-supplier=Newark; ComponentLink4Description: http://www.farnell.com/datasheets/2741162.pdf?src-supplier=Newark; ComponentLink5URL: http://www.farnell.com/datasheets/2120827.pdf?src-supplier=Element14; ComponentLink5Description: http://www.farnell.com/datasheets/2120827.pdf?src-supplier=Element14; ComponentLink6URL: http://capacitoredge.kemet.com/capedge2/DataSheet?pn=C0805C225K8RACAUTO&src-supplier=Avnet+Europe; ComponentLink6Description: http://capacitoredge.kemet.com/capedge2/DataSheet?pn=C0805C225K8RACAUTO&src-supplier=Avnet+Europe; ComponentLink7URL: https://search.kemet.com/component-edge/download/specsheet/C0805C225K8RACAUTO.pdf?src-supplier=Digi-Key; ComponentLink7Description: https://search.kemet.com/component-edge/download/specsheet/C0805C225K8RACAUTO.pdf?src-supplier=Digi-Key; ComponentLink8URL: https://api.kemet.com/component-edge/download/datasheet/C0805C225K8RACAUTO.pdf?src-supplier=Digi-Key; ComponentLink8Description: https://api.kemet.com/component-edge/download/datasheet/C0805C225K8RACAUTO.pdf?src-supplier=Digi-Key; Supplier Part Number 1: 399-6951-1-ND
C14 C15 = 0.1uF Cap: 0.1uF Bypass Cap; Manufacturer: KEMET; Manufacturer Part Number: C0603C104K9RACTU; Dielectric Material: Ceramic; Tolerance: 10%; Dielectric: X7R; Dissipation Factor: 5%; RoHS: Yes; Mount: Surface Mount; Case/Package: 0603; Case Code (Imperial): 0603; Case Code (Metric): 1608; Min Operating Temperature: -55°C; Max Operating Temperature: 125°C; Package Quantity: 4000; Packaging: Tape and Reel; Voltage Rating (DC): 6.3V; Termination: SMD/SMT; Length: 1.6mm; Height: 0.8mm; Width: 0.8mm; Thickness: 0.034inch; ComponentLink1URL: https://datasheet.ciiva.com/13371/kem-c1002-x7r-smd-357932-13371879.pdf?src-supplier=Mouser; ComponentLink1Description: https://datasheet.ciiva.com/13371/kem-c1002-x7r-smd-357932-13371879.pdf?src-supplier=Mouser; Supplier 1: Digi-Key; Stock 1: 758; Pricing 1: 1=0.19000, 10=0.13800, 100=0.06480, 500=0.04546, 1000=0.03763 (USD); Supplier Part Number 1: 399-15351-1-ND
C16 = ADC_Volt_Ref_Input_Bypass_CAP10uF: 10µF ±10% 6.3V Ceramic Capacitor X7R 0805 (2012 Metric); Manufacturer: Taiyo Yuden; Manufacturer Part Number: JMK212AB7106KGHT; Supplier 1: Digi-Key; RoHS: Yes; Stock 1: 179784; Pricing 1: 1 = 0.29000, 10 = 0.19900, 100 = 0.11250, 500 = 0.07940, 1000 = 0.06948 (USD); Mount: Surface Mount; Case/Package: 0805; Case Code (Metric): 2012; Case Code (Imperial): 0805; Min Operating Temperature: -55°C; Max Operating Temperature: 125°C; Package Quantity: 3000; Packaging: Tape and Reel; Tolerance: 10%; Voltage Rating (DC): 6.3V; Dielectric: X7R; Termination: SMD/SMT; Length: 0.079inch; Height: 1.25mm; Width: 0.049inch; Thickness: 0.053inch; Ratings: AEC-Q200; Lead Free: Lead Free; Halogen Free: Halogen Free; ComponentLink1URL: https://datasheet.ciiva.com/18697/mlcc01-hq-e-18697416.pdf?src-supplier=Digi-Key; ComponentLink1Description: https://datasheet.ciiva.com/18697/mlcc01-hq-e-18697416.pdf?src-supplier=Digi-Key; ComponentLink2URL: https://datasheet.ciiva.com/18697/mlcc01-hq-e-18697417.pdf?src-supplier=Digi-Key; ComponentLink2Description: https://datasheet.ciiva.com/18697/mlcc01-hq-e-18697417.pdf?src-supplier=Digi-Key; ComponentLink3URL: https://datasheet.ciiva.com/18697/mlcc01-hq-e-18697418.pdf?src-supplier=Digi-Key; ComponentLink3Description: https://datasheet.ciiva.com/18697/mlcc01-hq-e-18697418.pdf?src-supplier=Digi-Key; Supplier Part Number 1: 587-3388-1-ND
C17 = ADC_REF_VOLT_OUTPUT_CAP15UF: 15µF Molded Tantalum Capacitors 10V 1206 (3216 Metric) 1Ohm; Manufacturer: Kyocera AVX; Manufacturer Part Number: TPSA156K010R1000; Tolerance: 10%; ESR (Equivalent Series Resistance): 1R; Ripple Current: 110uA; Leakage Current: 1.5uA; Dissipation Factor: 6%; Polarity: Polar; Supplier 1: Digi-Key; RoHS: Yes; Stock 1: 4016; Pricing 1: 1 = 0.48000, 10 = 0.33300, 100 = 0.19980, 500 = 0.14986, 1000 = 0.12654 (USD); Mount: Surface Mount,PCB; Case/Package: 1206; Number of Pins: 2; Weight: 0.000571oz; Case Code (Metric): 3216; Case Code (Imperial): 1206; Dielectric Material: Tantalum; Min Operating Temperature: -55°C; Max Operating Temperature: 125°C; Packaging: Tape and Reel; Voltage Rating (DC): 10V; Package Quantity: 1; Termination: SMD/SMT; Voltage: 10V; Features: General Purpose; Length: 3.2mm; Height: 1.6mm; Width: 1.6mm; Height - Seated (Max): 0.071inch; Depth: 1.6mm; Radiation Hardening: No; REACH SVHC: No SVHC; Lead Free: Lead Free; ComponentLink1URL: https://datasheet.ciiva.com/11793/0900766b80962b61-11793618.pdf?src-supplier=RSComponents; ComponentLink1Description: https://datasheet.ciiva.com/11793/0900766b80962b61-11793618.pdf?src-supplier=RSComponents; ComponentLink2URL: https://datasheet.ciiva.com/19467/2019434-19467308.pdf?src-supplier=Jameco; ComponentLink2Description: https://datasheet.ciiva.com/19467/2019434-19467308.pdf?src-supplier=Jameco; ComponentLink3URL: https://datasheet.ciiva.com/263/tps-263720.pdf?src-supplier=Digi-Key; ComponentLink3Description: https://datasheet.ciiva.com/263/tps-263720.pdf?src-supplier=Digi-Key; ComponentLink4URL: https://datasheet.ciiva.com/263/tps-263721.pdf?src-supplier=Digi-Key; ComponentLink4Description: https://datasheet.ciiva.com/263/tps-263721.pdf?src-supplier=Digi-Key; ComponentLink5URL: https://datasheet.ciiva.com/7914/1680477-7914730.pdf?src-supplier=Element14; ComponentLink5Description: https://datasheet.ciiva.com/7914/1680477-7914730.pdf?src-supplier=Element14; ComponentLink6URL: https://datasheet.ciiva.com/263/tps-263722.pdf?src-supplier=Digi-Key; ComponentLink6Description: https://datasheet.ciiva.com/263/tps-263722.pdf?src-supplier=Digi-Key; ComponentLink7URL: https://datasheet.ciiva.com/3004/tps-3004586.pdf?src-supplier=Avnet; ComponentLink7Description: https://datasheet.ciiva.com/3004/tps-3004586.pdf?src-supplier=Avnet; ComponentLink8URL: https://datasheet.ciiva.com/12911/tps-23028-12911578.pdf?src-supplier=Mouser; ComponentLink8Description: https://datasheet.ciiva.com/12911/tps-23028-12911578.pdf?src-supplier=Mouser; ComponentLink9URL: https://datasheet.ciiva.com/14596/70001047-14596906.pdf?src-supplier=Allied+Electronics; ComponentLink9Description: https://datasheet.ciiva.com/14596/70001047-14596906.pdf?src-supplier=Allied+Electronics; ComponentLink10URL: https://datasheet.ciiva.com/7914/1680477-7914731.pdf?src-supplier=Element14; ComponentLink10Description: https://datasheet.ciiva.com/7914/1680477-7914731.pdf?src-supplier=Element14; ComponentLink11URL: https://datasheet.ciiva.com/7914/1680477-7914732.pdf?src-supplier=Element14; ComponentLink11Description: https://datasheet.ciiva.com/7914/1680477-7914732.pdf?src-supplier=Element14; Supplier Part Number 1: 478-1752-1-ND
C18 = ADC_REF_VOLT_TRIM_CAP2.2UF: 2.2µF ±10% 6.3V Ceramic Capacitor X7R 0603 (1608 Metric); Manufacturer: Taiyo Yuden; Manufacturer Part Number: JMK107B7225KAHTR; Supplier 1: Digi-Key; RoHS: No; Stock 1: 55560; Pricing 1: 1 = 0.24000, 10 = 0.16600, 100 = 0.09400, 500 = 0.06638, 1000 = 0.05808 (USD); Mount: Surface Mount; Case/Package: 0603; Case Code (Imperial): 0603; Case Code (Metric): 1608; Min Operating Temperature: -55°C; Max Operating Temperature: 125°C; Packaging: Cut Tape; Tolerance: 10%; Ratings: AEC-Q200; ComponentLink1URL: http://ds.yuden.co.jp/TYCOMPAS/ut/detail.do?productNo=JMK107B7225KAHTR&fileName=JMK107B7225KAHTR_SS&mode=specSheetDownload&src-supplier=Digi-Key; ComponentLink1Description: http://ds.yuden.co.jp/TYCOMPAS/ut/detail.do?productNo=JMK107B7225KAHTR&fileName=JMK107B7225KAHTR_SS&mode=specSheetDownload&src-supplier=Digi-Key; ComponentLink2URL: https://www.yuden.co.jp/productdata/catalog//mlcc11_hq_e.pdf?src-supplier=Digi-Key; ComponentLink2Description: https://www.yuden.co.jp/productdata/catalog//mlcc11_hq_e.pdf?src-supplier=Digi-Key; Supplier Part Number 1: 587-4899-1-ND
D1 = GREEN_LED: Manufacturer: Dialight; Manufacturer Part Number: 5988070107F; Color: Green; Lens Color: Colorless,Clear; Forward Voltage: 2V; Forward Current: 20mA; Wavelength: 570nm; Luminous Intensity: 20mcd; Viewing Angle: 140°; Lens Style: Flat,Rectangular,Diffused,Colorless,Clear; Dominant Wavelength: 568nm; Number of Elements: 1; Power Dissipation: 60mW; Reverse Voltage: 5V; Lens Transparency: Clear; Lens Size: 0.8mm; Supplier 1: Digi-Key; Stock 1: 228546; Pricing 1: 1=0.46, 10=0.33, 25=0.2528, 100=0.1648, 250=0.1209, 500=0.1026, 1000=0.0843 (USD); Mount: Surface Mount; Case/Package: 0603; Number of Pins: 2; Case Code (Metric): 1608; Case Code (Imperial): 0603; Min Operating Temperature: -30°C; Max Operating Temperature: 100°C; Package Quantity: 4000; Packaging: Tape and Reel; Illumination Color: Green; Test Current: 20mA; Number of LEDs: 1; Length: 1.6mm; Height: 0.7mm; Depth: 0.8mm; Width: 0.8mm; Radiation Hardening: No; Lead Free: Lead Free; REACH SVHC: No SVHC; ComponentLink1URL: http://www.mouser.com/ds/2/109/SMT_selector_guide-267443.pdf?src-supplier=Mouser; ComponentLink1Description: http://www.mouser.com/ds/2/109/SMT_selector_guide-267443.pdf?src-supplier=Mouser; ComponentLink2URL: http://uk.rs-online.com/webdocs/0ae2/0900766b80ae2975.pdf?src-supplier=RSComponents; ComponentLink2Description: http://uk.rs-online.com/webdocs/0ae2/0900766b80ae2975.pdf?src-supplier=RSComponents; ComponentLink3URL: http://www.farnell.com/datasheets/1720200.pdf?src-supplier=Element14; ComponentLink3Description: http://www.farnell.com/datasheets/1720200.pdf?src-supplier=Element14; ComponentLink4URL: https://media.digikey.com/pdf/Data%20Sheets/Dialight%20PDFs/598_Series_0603_Pkg.pdf?src-supplier=Digi-Key; ComponentLink4Description: https://media.digikey.com/pdf/Data%20Sheets/Dialight%20PDFs/598_Series_0603_Pkg.pdf?src-supplier=Digi-Key; ComponentLink5URL: http://www.farnell.com/datasheets/1484480.pdf?src-supplier=Element14; ComponentLink5Description: http://www.farnell.com/datasheets/1484480.pdf?src-supplier=Element14; ComponentLink6URL: https://www.alliedelec.com/m/d/745256ca487aea7b70ea31e2d673d5bb.pdf?src-supplier=Allied+Electronics; ComponentLink6Description: https://www.alliedelec.com/m/d/745256ca487aea7b70ea31e2d673d5bb.pdf?src-supplier=Allied+Electronics; ComponentLink7URL: http://www.onlinecomponents.com/productFiles/mf-DIA/mdei5980603.pdf?src-supplier=Onlinecomponents.com; ComponentLink7Description: http://www.onlinecomponents.com/productFiles/mf-DIA/mdei5980603.pdf?src-supplier=Onlinecomponents.com; ComponentLink8URL: https://www.verical.com/server-webapp/html/getDatasheet?partID=146438&src-supplier=Verical; ComponentLink8Description: https://www.verical.com/server-webapp/html/getDatasheet?partID=146438&src-supplier=Verical; ComponentLink9URL: http://www.dialight.com/Assets/Brochures_And_Catalogs/Indication/SMT_selector_guide.pdf?src-supplier=Future+Electronics; ComponentLink9Description: http://www.dialight.com/Assets/Brochures_And_Catalogs/Indication/SMT_selector_guide.pdf?src-supplier=Future+Electronics; Supplier Part Number 1: 350-2035-1-ND
P3 = 2 Pos Power Header without 3D body: No supplier part for this schematic symbol, only here to create board to board holes for the power header
R16 = Green_LED_Res: Manufacturer: Panasonic; Manufacturer Part Number: ERJ-1GNF90R9C; Power Rating: 50mW; Tolerance: 1%; Voltage Rating: 25V; Temperature Coefficient: 200ppm/°C; Voltage Rating (DC): 50V; Mount: Surface Mount; Case/Package: 0201; Case Code (Imperial): 0201; Case Code (Metric): 0603; Contact Plating: Tin,Matte; Min Operating Temperature: -55°C; Max Operating Temperature: 125°C; Package Quantity: 15000; Packaging: Tape and Reel; Composition: Thick Film; Number of Terminations: 2; Max Power Dissipation: 50mW; Termination: SMD/SMT; Length: 0.024inch; Height: 0.01inch; Width: 0.3mm; Radiation Hardening: No; Supplier 1: Digi-Key; Stock 1: 401780; Pricing 1: 1=0.10000, 10=0.02400, 100=0.00970, 1000=0.00437, 2500=0.00379 (USD); RoHS: Yes; Military Standard: Not; Depth: 0.8mm; Lead Free: Lead Free; ComponentLink1URL: https://datasheet.ciiva.com/15189/getdatasheetpartid-326528-15189836.pdf?src-supplier=Verical; ComponentLink1Description: https://datasheet.ciiva.com/15189/getdatasheetpartid-326528-15189836.pdf?src-supplier=Verical; ComponentLink2URL: https://datasheet.ciiva.com/12558/rc0603-272842-12558285.pdf?src-supplier=Mouser; ComponentLink2Description: https://datasheet.ciiva.com/12558/rc0603-272842-12558285.pdf?src-supplier=Mouser; Supplier Part Number 1: 311-90.9HRCT-ND
U2 = 3.3V Digital ADC Supply: Linear Voltage Regulator IC  1 Output  200mA SOT-23-5; Manufacturer: Texas Instruments; Manufacturer Part Number: TPS79333DBVRQ1; Number of Outputs: 1; Max Supply Voltage: 5.5V; Min Supply Voltage: 2.7V; Dropout Voltage: 102mV; Max Power Dissipation: 561mW; Input Bias Current: 170uA; Min Current Limit: 285mA; Polarity: Positive; Quiescent Current: 200uA; Output Voltage Accuracy: 2%; Output Type: Fixed; Supplier 1: Digi-Key; Stock 1: 3595; Pricing 1: 1=0.86000, 10=0.75600, 100=0.53820, 500=0.43510, 1000=0.33205 (USD); RoHS: Yes; Case/Package: SOT-23; Number of Pins: 5; Contact Plating: Gold; Min Operating Temperature: -40°C; Max Operating Temperature: 125°C; Package Quantity: 1; Output Current: 200mA; Output Voltage: 3.3V; Packaging: Tape and Reel; Nominal Output Voltage: 3.3V; Max Output Current: 200mA; Max Input Voltage: 5.5V; Min Input Voltage: 2.7V; Number of Regulators: 1; Power Dissipation: 561mW; Min Output Voltage: 3.3V; Max Output Voltage: 3.3V; Termination: SMD/SMT; Accuracy: 2%; Radiation Hardening: No; Lead Free: Lead Free; REACH SVHC: No SVHC; ComponentLink1URL: https://datasheet.ciiva.com/14277/tps79301-q1-14277552.pdf?src-supplier=Avnet; ComponentLink1Description: https://datasheet.ciiva.com/14277/tps79301-q1-14277552.pdf?src-supplier=Avnet; ComponentLink2URL: https://datasheet.ciiva.com/22700/1845238-22700085.pdf?src-supplier=Element14; ComponentLink2Description: https://datasheet.ciiva.com/22700/1845238-22700085.pdf?src-supplier=Element14; ComponentLink3URL: https://datasheet.ciiva.com/7993/1781686-7993219.pdf?src-supplier=Element14; ComponentLink3Description: https://datasheet.ciiva.com/7993/1781686-7993219.pdf?src-supplier=Element14; ComponentLink4URL: https://datasheet.ciiva.com/28684/1887604-28684539.pdf?src-supplier=Element14; ComponentLink4Description: https://datasheet.ciiva.com/28684/1887604-28684539.pdf?src-supplier=Element14
U3 = 8Pin_ADC_REF_V: Manufacturer: Texas Instruments; Manufacturer Part Number: REF5025AQDRQ1; Max Input Voltage: 18V; Output Voltage: 2.5V; Min Input Voltage: 2.7V; Nominal Supply Current: 800uA; Tolerance: 0.1%; Max Output Current: 10mA; Operating Supply Current: 1.2mA; Temperature Coefficient: 3ppm/°C; Reference Type: Series; Output Type: Fixed; Number of Channels: 1; Case/Package: D; Number of Pins: 8; Weight: 0.002677oz; Min Operating Temperature: -40°C; Max Operating Temperature: 125°C; Packaging: Tape and Reel; Package Quantity: 1; Min Output Voltage: 2.5V; Output Current: 10mA; Max Output Voltage: 2.5V; Quiescent Current: 800uA; Radiation Hardening: No; Lead Free: Lead Free; ComponentLink1URL: http://www.ti.com/lit/ds/symlink/ref5025a-q1.pdf; ComponentLink1Description: http://www.ti.com/lit/ds/symlink/ref5025a-q1.pdf; ComponentLink2URL: http://www.ti.com/lit/ds/symlink/ref5020a-q1.pdf?src-supplier=Digi-Key; ComponentLink2Description: http://www.ti.com/lit/ds/symlink/ref5020a-q1.pdf?src-supplier=Digi-Key; ComponentLink3URL: http://www.ti.com/lit/ds/symlink/ref5030a-q1.pdf?src-supplier=Digi-Key; ComponentLink3Description: http://www.ti.com/lit/ds/symlink/ref5030a-q1.pdf?src-supplier=Digi-Key; Supplier 1: Digi-Key; Stock 1: 16802; Pricing 1: 1=3.54, 10=3.182, 100=2.607, 500=2.2193, 1000=1.8717 (USD)

## Nets that join several sheets
+3.3V_AN: GND_PCB_Data_Conversion (R1.2 R2.2 U1.5 U1.29), ADC_PowerSupply (8 pins)
AGND: GND_PCB_Data_Conversion (25 pins), 4X_22_GND_Pin_Connector (92 pins), ADC_PowerSupply (12 pins)
+VBD: GND_PCB_Data_Conversion (U1.36), ADC_PowerSupply (C13.2 U2.5)
VREF: GND_PCB_Data_Conversion (U1.4), ADC_PowerSupply (C17.2 U3.6)